# Altium schematic sheet RCAuto.SchDoc
size D
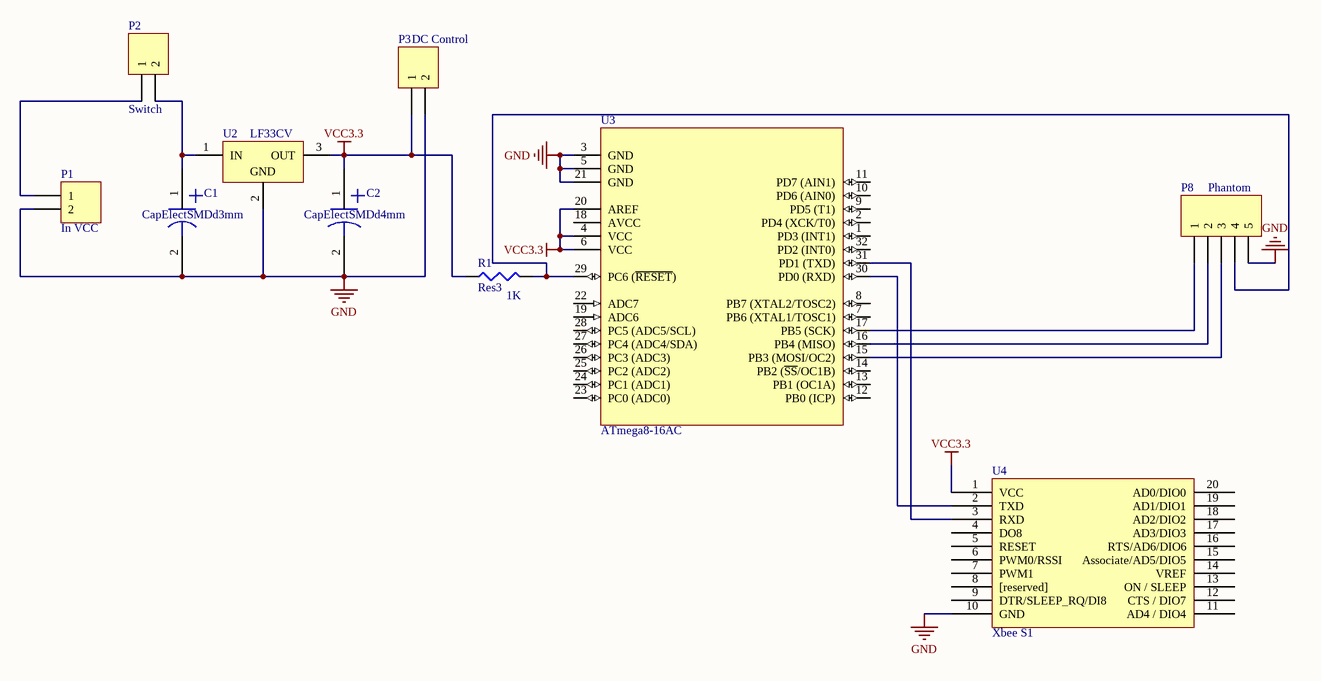
[diagram p0: RCAuto.SchDoc]

## Parts
C1  CapElectSMDd3mm  [CapElectSMDd3mm]
C2  CapElectSMDd4mm  [CapElectSMDd4mm]
P1  In VCC  [HDR1X2]
P2  Switch  [HDR1X2]
P3  DC Control  [HDR1X2]
P8  Phantom  [HDR1X5]
R1  Res3  value 1K  [14-1206]
U2  LF33CV  [TO-220A]
U3  ATmega8-16AC  [32A_N]
U4  Xbee S1  [Xbee S1]

## Nets
GND: C1.2 C2.2 P1.2 P3.2 P8.5 U2.2(GND) U3.3(GND) U3.5(GND) U3.21(GND) U4.10(GND)
VCC3.3: C2.1 P3.1 R1.1 U2.3(OUT) U3.4(VCC) U3.6(VCC) U3.20(AREF) U4.1(VCC)
NetC1_1: C1.1 P2.2 U2.1(IN)
NetP1_1: P1.1 P2.1
NetP8_1: P8.1 U3.17(PB5_(SCK))
NetP8_2: P8.2 U3.16(PB4_(MISO))
NetP8_3: P8.3 U3.15(PB3_(MOSI/OC2))
NetP8_4: P8.4 R1.2 U3.29(PC6_(~{RESET}))
NetU3_30: U3.30(PD0_(RXD)) U4.2(TXD)
NetU3_31: U3.31(PD1_(TXD)) U4.3(RXD)

Not connected (* = marked no-connect by the designer): U3 1(PD3_(INT1)) 2(PD4_(XCK/T0)) 7(PB6_(XTAL1/TOSC1)) 8(PB7_(XTAL2/TOSC2)) 9(PD5_(T1)) 10(PD6_(AIN0)) 11(PD7_(AIN1)) 12(PB0_(ICP)) 13(PB1_(OC1A)) 14(PB2_(~{SS}/OC1B)) 18(AVCC) 19(ADC6) 22(ADC7) 23(PC0_(ADC0)) 24(PC1_(ADC1)) 25(PC2_(ADC2)) 26(PC3_(ADC3)) 27(PC4_(ADC4/SDA)) 28(PC5_(ADC5/SCL)) 32(PD2_(INT0)); U4 4(DO8) 5(RESET) 6(PWM0/RSSI) 7(PWM1) 8([reserved]) 9(DTR/SLEEP_RQ/DI8) 11(AD4_/_DIO4) 12(CTS_/_DIO7) 13(ON_/_SLEEP) 14(VREF) 15(Associate/AD5/DIO5) 16(RTS/AD6/DIO6) 17(AD3/DIO3) 18(AD2/DIO2) 19(AD1/DIO1) 20(AD0/DIO0)

## Notes on the sheet
- Title
- Size:
- Date:
- File:
- D
- Number:
- Time:
- Revision:
- Sheet
- of

## Library data of the parts
P1-P3 = Header 2: Header, 2-Pin; LatestRevisionDate: 17-Jul-2002; LatestRevisionNote: Re-released for DXP Platform.; Publisher: Altium Limited
P8 = Header 5: Header, 5-Pin; LatestRevisionDate: 17-Jul-2002; LatestRevisionNote: Re-released for DXP Platform.; Publisher: Altium Limited
R1 = Res3: Resistor; Published: 8-Jun-2000; LatestRevisionDate: 29-May-2009; LatestRevisionNote: IPC-7351 Footprint Added.; PackageReference: J1-0603; Publisher: Altium Limited; PackageDescription: Chip Resistor
U2 = LF33CV: 500mA, Very Low Drop (0.45V) Voltage Regulator; Published: 24-Aug-2001; LatestRevisionDate: 06-Jun-2005; LatestRevisionNote: PCB Pin sequence re-ordered.; DatasheetVersion: Feb-2004; PackageVersion: Jul-2004; PackageReference: TO-220A; Publisher: Altium Limited; PackageDescription: TO, Thru-Hole, Vertical, Heatsink Mounted; 3 In-Line Leads; Pitch 2.54 mm; ComponentLink1Description: Manufacturer Link; ComponentLink1URL: http://www.st.com/; ComponentLink2Description: Datasheet; ComponentLink2URL: http://www.st.com/stonline/books/pdf/docs/2574.pdf
U3 = ATmega8-16AC: 8-Bit AVR Microcontroller with 8K Bytes of In-System Programmable Flash Memory; Published: 17-Sep-2003; LatestRevisionDate: 13-Apr-2006; LatestRevisionNote: IPC-7351 Footprint Added.; DatasheetVersion: 2486H-AVR-09/02; PackageVersion: revB, Oct-2001; PackageReference: 32A; Publisher: Altium Limited; PackageDescription: 32-Pin Thin Quad Flat Pack 0.8 mm Pitch; Code_JEDEC: MS-026-ABA; ComponentLink1Description: Manufacturer Link; ComponentLink1URL: http://www.atmel.com; ComponentLink2Description: Datasheet; ComponentLink2URL: http://www.atmel.com/dyn/resources/prod_documents/doc2486.pdf